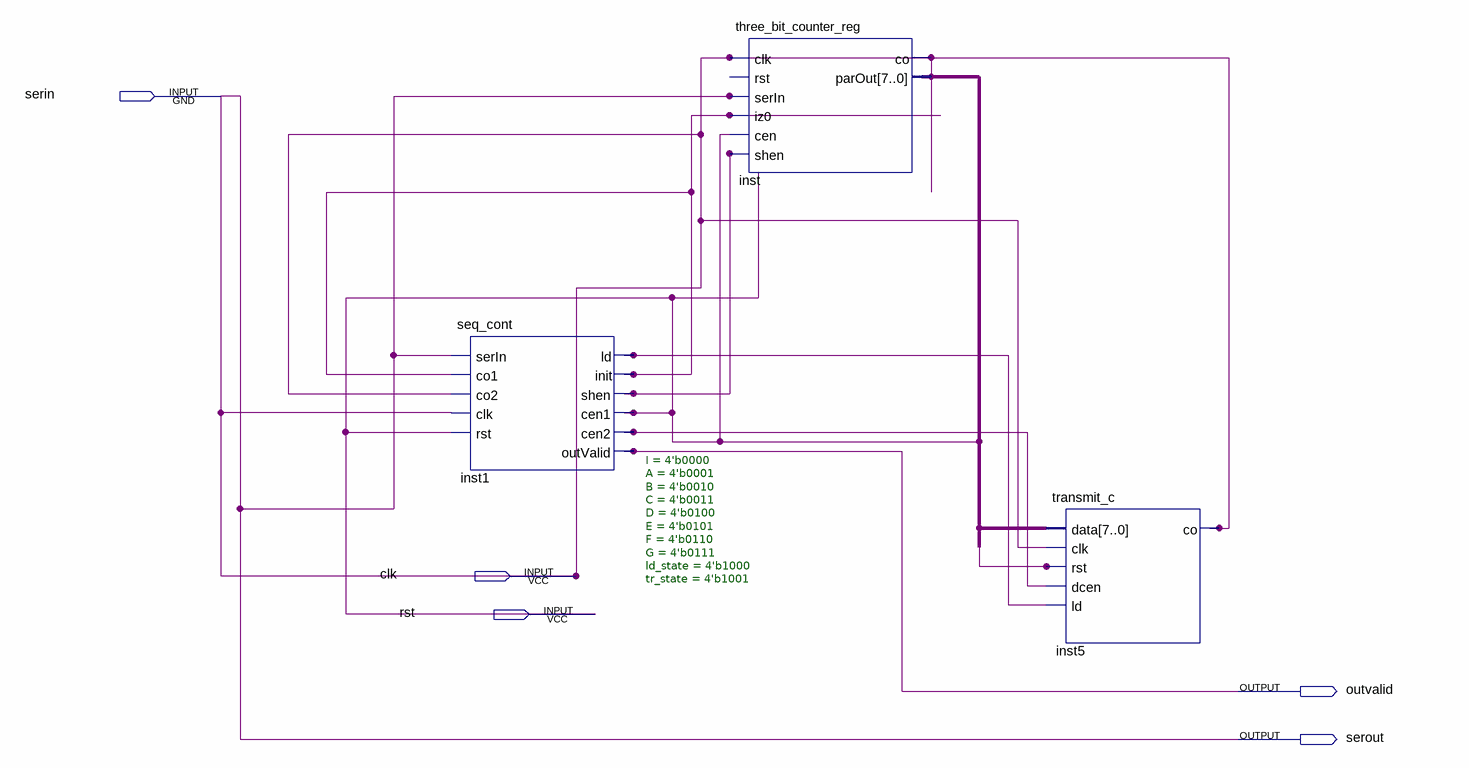
[diagram p0: schematic sheet]
// Quartus schematic complete.bdf as structural Verilog: 3 symbols, 5 pins
module complete (
  input  serin,
  input  clk,
  input  rst,
  output outvalid,
  output serout
);

  wire inst1_cen2, inst1_init, inst1_ld, inst1_shen, undriven;
  wire [7:0] inst_parout;

  seq_cont #(.I(4'b0000), .A(4'b0001), .B(4'b0010), .C(4'b0011), .D(4'b0100), .E(4'b0101), .F(4'b0110), .G(4'b0111), .ld_state(4'b1000), .tr_state(4'b1001)) inst1 (
    .serIn(clk), .co1(inst1_init), .co2(clk), .clk(clk), .rst(rst), .ld(inst1_ld), .init(inst1_init),
    .shen(inst1_shen), .cen1(rst), .cen2(inst1_cen2), .outValid(outvalid));
  three_bit_counter_reg inst (
    .clk(clk), .serIn(clk), .iz0(inst1_init), .cen(rst), .shen(inst1_shen), .co(clk), .parOut(inst_parout));  // open: rst
  transmit_c inst5 (.data(inst_parout), .clk(clk), .rst(undriven), .dcen(inst1_cen2), .ld(inst1_ld), .co(clk));

  assign serin = clk;
  assign serout = clk;
endmodule
